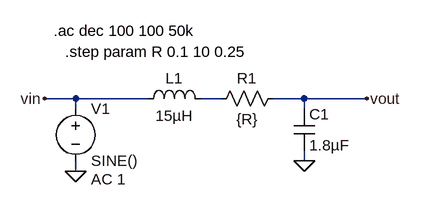
[diagram p0: schematic classD-LC.asc]
classD-LC.asc, the LTspice schematic file:
Version 4
SHEET 1 880 680
WIRE -240 112 -288 112
WIRE -128 112 -240 112
WIRE -16 112 -48 112
WIRE 112 112 64 112
WIRE 208 112 112 112
WIRE -240 128 -240 112
WIRE 112 128 112 112
WIRE 112 208 112 192
WIRE -240 224 -240 208
FLAG 112 208 0
FLAG -288 112 vin
FLAG 208 112 vout
FLAG -240 224 0
SYMBOL ind -144 128 R270
WINDOW 0 32 56 VTop 2
WINDOW 3 5 56 VBottom 2
SYMATTR InstName L1
SYMATTR Value 15µH
SYMBOL cap 96 128 R0
SYMATTR InstName C1
SYMATTR Value 1.8µF
SYMBOL res 80 96 R90
WINDOW 0 0 56 VBottom 2
WINDOW 3 32 56 VTop 2
SYMATTR InstName R1
SYMATTR Value {R}
SYMBOL voltage -240 112 R0
WINDOW 123 24 124 Left 2
WINDOW 39 0 0 Left 0
SYMATTR InstName V1
SYMATTR Value SINE()
SYMATTR Value2 AC 1
TEXT -274 8 Left 2 !.ac dec 100 100 50k
TEXT -256 40 Left 2 !.step param R 0.1 10 0.25

The netlist it stands for:
* classD-LC.asc
L1 vin N001 15µH
C1 vout 0 1.8µF
R1 vout N001 {R}
V1 vin 0 SINE() AC 1
.ac dec 100 100 50k
.step param R 0.1 10 0.25
.backanno
.end